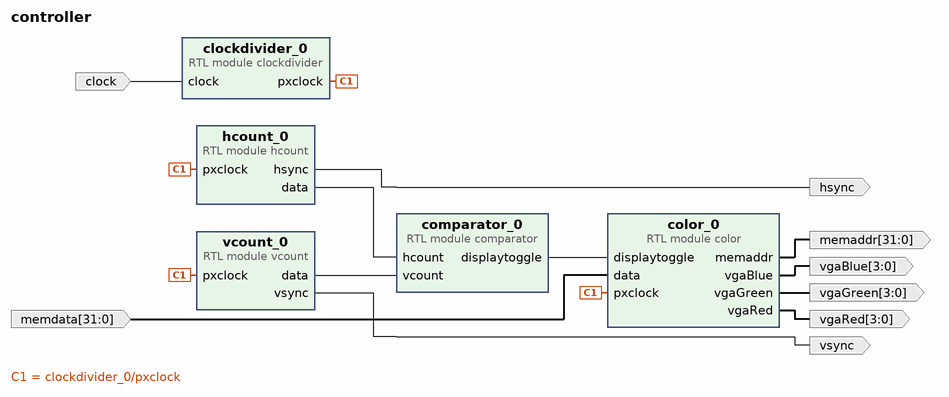
[diagram p0: block diagram of the top level]
# Vivado block design controller, xc7a35tcpg236-1, Vivado 2022.2
create_bd_design controller

create_bd_port -dir O vsync
create_bd_port -dir O hsync
create_bd_port -dir I -from 31 -to 0 memdata
create_bd_port -dir O -from 31 -to 0 memaddr
create_bd_port -dir O -from 3 -to 0 vgaRed
create_bd_port -dir O -from 3 -to 0 vgaGreen
create_bd_port -dir O -from 3 -to 0 vgaBlue
create_bd_port -dir I clock

create_bd_cell -type module -reference color color_0
create_bd_cell -type module -reference hcount hcount_0
create_bd_cell -type module -reference vcount vcount_0
create_bd_cell -type module -reference comparator comparator_0
create_bd_cell -type module -reference clockdivider clockdivider_0

# ---- connections ----

connect_bd_net [get_bd_ports clock] [get_bd_pins clockdivider_0/clock]
connect_bd_net [get_bd_pins color_0/memaddr] [get_bd_ports memaddr]
connect_bd_net [get_bd_pins color_0/vgaBlue] [get_bd_ports vgaBlue]
connect_bd_net [get_bd_pins color_0/vgaGreen] [get_bd_ports vgaGreen]
connect_bd_net [get_bd_pins color_0/vgaRed] [get_bd_ports vgaRed]
connect_bd_net [get_bd_pins comparator_0/displaytoggle] [get_bd_pins color_0/displaytoggle]
connect_bd_net [get_bd_pins hcount_0/data] [get_bd_pins comparator_0/hcount]
connect_bd_net [get_bd_pins hcount_0/hsync] [get_bd_ports hsync]
connect_bd_net [get_bd_ports memdata] [get_bd_pins color_0/data]
connect_bd_net -net pixelclock_1 [get_bd_pins clockdivider_0/pxclock] \
  [get_bd_pins color_0/pxclock] [get_bd_pins hcount_0/pxclock] [get_bd_pins vcount_0/pxclock]
connect_bd_net [get_bd_pins vcount_0/data] [get_bd_pins comparator_0/vcount]
connect_bd_net [get_bd_pins vcount_0/vsync] [get_bd_ports vsync]

validate_bd_design
save_bd_design
